# Altium schematic sheet Channel.SchDoc
size A4; SheetNumber: 2; SheetTotal: 2
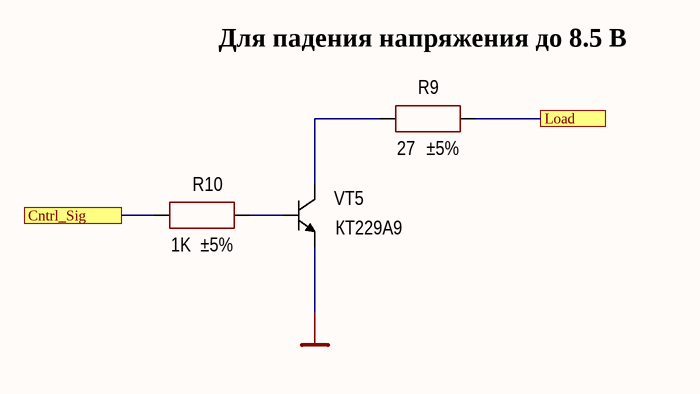
[diagram p0: Channel.SchDoc]

## Parts
R9  value 27  Tolerance: ±5%  [RES: 0805]
R10  value 1K  Tolerance: ±5%  [RES: 0805]
VT5  PartNumber: КТ229А9  [SOT23]

## Ports
Cntrl_Sig, Load

## Nets
GND: VT5.2(E)
Cntrl_Sig: R10.1 ; port Cntrl_Sig
Load: R9.2 ; port Load
NetR9_1: R9.1 VT5.3(C)
NetR10_2: R10.2 VT5.1(B)

## Notes on the sheet
- (near R9) Для падения напряжения до 8.5 В

## Library data of the parts
R9 = Resistor_0805: Manufacturer: Yageo; PartNumber: RC0805JR-07100RL; ValueManufacturerPartNumber: Resistor film, 27, ±5%, 0805, 0.125W, -55...+125°C; TypeResistor: Resistor film; Power: 0.125W; Package: 0805; HelpURL: https://www.digikey.com/product-detail/en/yageo/RC0805JR-07100RL/311-100ARCT-ND/731185; Temperature: -55...+125°C
R10 = Resistor_0805: Manufacturer: Yageo; PartNumber: RC0805JR-07100RL; ValueManufacturerPartNumber: Resistor film, 1K, ±5%, 0805, 0.125W, -55...+125°C; TypeResistor: Resistor film; Power: 0.125W; Package: 0805; HelpURL: https://www.digikey.com/product-detail/en/yageo/RC0805JR-07100RL/311-100ARCT-ND/731185; Temperature: -55...+125°C
VT5 = BJT_NPN_132: Manufacturer: ON Semiconductor; ValueManufacturerPartNumber: NPN transistor, 45V, 100mA, 100MHz, 300mW, 0.6V, 420, SOT-23, -55...+125°C; TypeTransistor: NPN transistor; VoltageCE: 45V; CurrentCE: 100mA; VoltageSaturation: 0.6V; Frequency: 100MHz; CurrentGain: 420; MaxPower: 300mW; Package: SOT-23; HelpURL: https://www.digikey.com/product-detail/en/on-semiconductor/BC847CLT1G/BC847CLT1GOSCT-ND/917836; Temperature: -55...+125°C